# Altium project DE-270624.PrjPcb
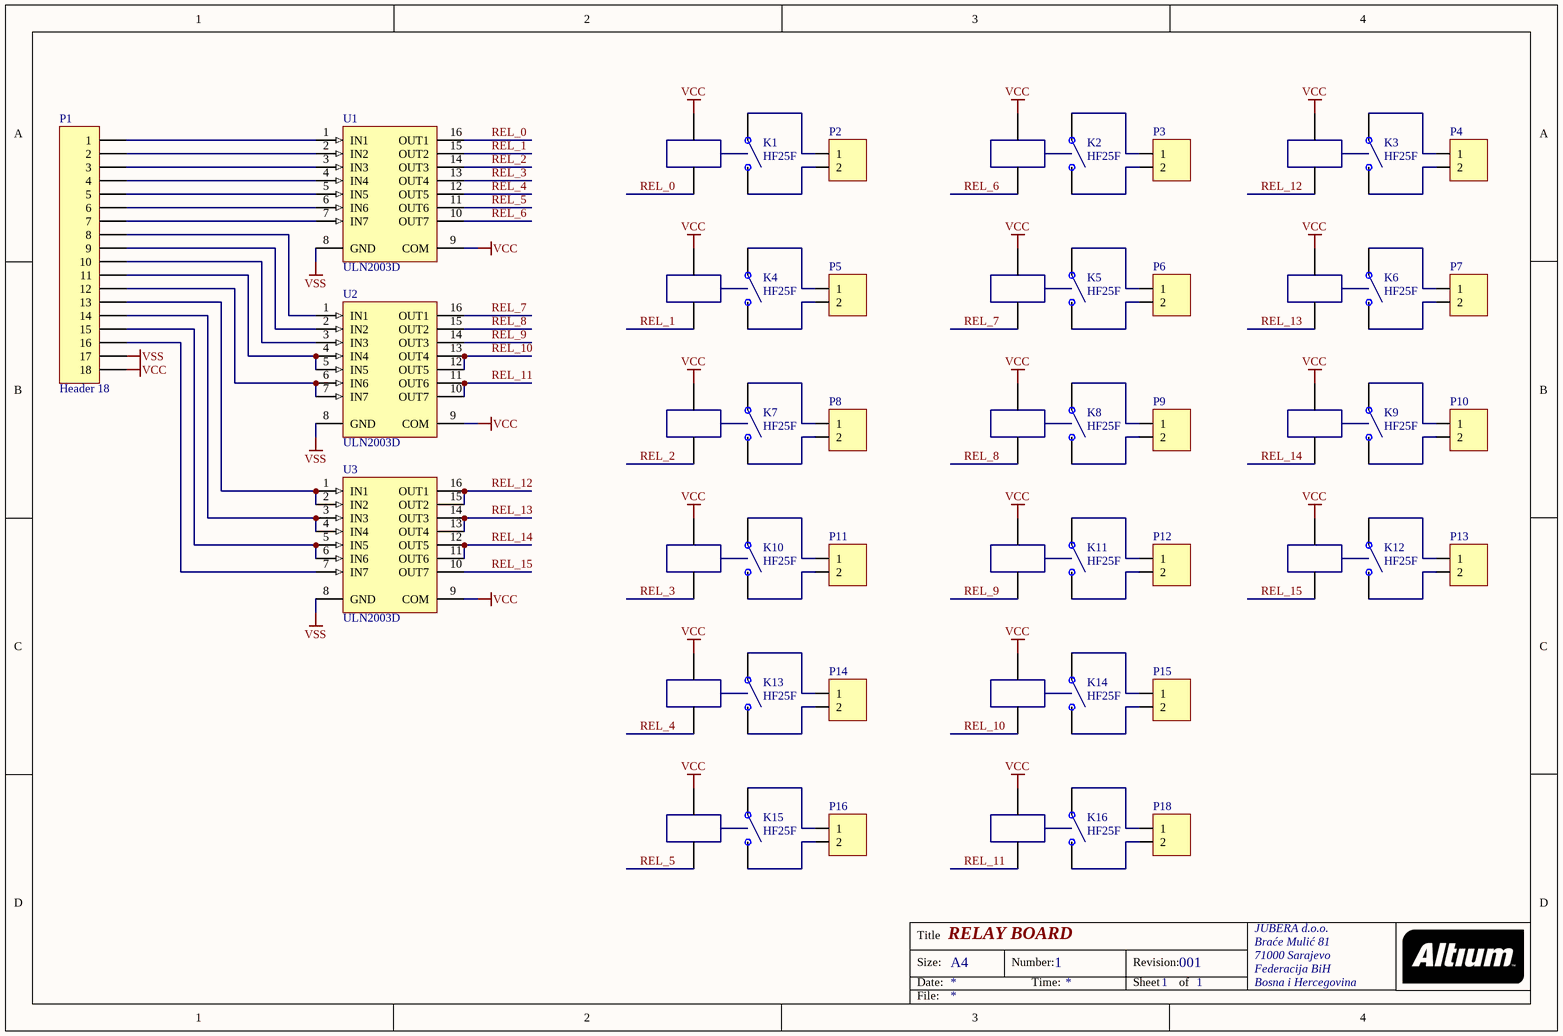
[diagram p0: DE-270624.SchDoc]
1 sheet, 36 parts. Net scope: global (net labels, ports and power ports of the same name join across sheets).
Board file: DE-270624.PcbDoc

## Sheet DE-270624.SchDoc: RELAY BOARD
size A4; Author: eldar6776@hotmail.com; DrawnBy: Eldar Dedić; Organization: JUBERA d.o.o.; Address1: Braće Mulić 81; Address2: 71000 Sarajevo; Address3: Federacija BiH; Address4: Bosna i Hercegovina; DocumentNumber: 1; Revision: 001; SheetNumber: 1; SheetTotal: 1; ProjectName: DE'270124

### Parts
K1  HF25F  [HF25F]
K2  HF25F  [HF25F]
K3  HF25F  [HF25F]
K4  HF25F  [HF25F]
K5  HF25F  [HF25F]
K6  HF25F  [HF25F]
K7  HF25F  [HF25F]
K8  HF25F  [HF25F]
K9  HF25F  [HF25F]
K10  HF25F  [HF25F]
K11  HF25F  [HF25F]
K12  HF25F  [HF25F]
K13  HF25F  [HF25F]
K14  HF25F  [HF25F]
K15  HF25F  [HF25F]
K16  HF25F  [HF25F]
P1  Header 18  [HDR1X18]
P2  220Vac  [TERMINAL BLOK 2 - 3,5mm]  (value not drawn)
P3  220Vac  [TERMINAL BLOK 2 - 3,5mm]  (value not drawn)
P4  220Vac  [TERMINAL BLOK 2 - 3,5mm]  (value not drawn)
P5  220Vac  [TERMINAL BLOK 2 - 3,5mm]  (value not drawn)
P6  220Vac  [TERMINAL BLOK 2 - 3,5mm]  (value not drawn)
P7  220Vac  [TERMINAL BLOK 2 - 3,5mm]  (value not drawn)
P8  220Vac  [TERMINAL BLOK 2 - 3,5mm]  (value not drawn)
P9  220Vac  [TERMINAL BLOK 2 - 3,5mm]  (value not drawn)
P10  220Vac  [TERMINAL BLOK 2 - 3,5mm]  (value not drawn)
P11  220Vac  [TERMINAL BLOK 2 - 3,5mm]  (value not drawn)
P12  220Vac  [TERMINAL BLOK 2 - 3,5mm]  (value not drawn)
P13  220Vac  [TERMINAL BLOK 2 - 3,5mm]  (value not drawn)
P14  220Vac  [TERMINAL BLOK 2 - 3,5mm]  (value not drawn)
P15  220Vac  [TERMINAL BLOK 2 - 3,5mm]  (value not drawn)
P16  220Vac  [TERMINAL BLOK 2 - 3,5mm]  (value not drawn)
P18  220Vac  [TERMINAL BLOK 2 - 3,5mm]  (value not drawn)
U1  ULN2003D  [SO16_N]
U2  ULN2003D  [SO16_N]
U3  ULN2003D  [SO16_N]

### Nets
VCC: K1.1 K2.1 K3.1 K4.1 K5.1 K6.1 K7.1 K8.1 K9.1 K10.1 K11.1 K12.1 K13.1 K14.1 K15.1 K16.1 P1.18 U1.9(COM) U2.9(COM) U3.9(COM)
VSS: P1.17 U1.8(GND) U2.8(GND) U3.8(GND)
REL_0: K1.2 U1.16(OUT1)
REL_1: K4.2 U1.15(OUT2)
REL_2: K7.2 U1.14(OUT3)
REL_3: K10.2 U1.13(OUT4)
REL_4: K13.2 U1.12(OUT5)
REL_5: K15.2 U1.11(OUT6)
REL_6: K2.2 U1.10(OUT7)
REL_7: K5.2 U2.16(OUT1)
REL_8: K8.2 U2.15(OUT2)
REL_9: K11.2 U2.14(OUT3)
REL_10: K14.2 U2.12(OUT5) U2.13(OUT4)
REL_11: K16.2 U2.10(OUT7) U2.11(OUT6)
REL_12: K3.2 U3.15(OUT2) U3.16(OUT1)
REL_13: K6.2 U3.13(OUT4) U3.14(OUT3)
REL_14: K9.2 U3.11(OUT6) U3.12(OUT5)
REL_15: K12.2 U3.10(OUT7)
NetK1_3: K1.3 P2.1
NetK1_4: K1.4 P2.2
NetK2_3: K2.3 P3.1
NetK2_4: K2.4 P3.2
NetK3_3: K3.3 P4.1
NetK3_4: K3.4 P4.2
NetK4_3: K4.3 P5.1
NetK4_4: K4.4 P5.2
NetK5_3: K5.3 P6.1
NetK5_4: K5.4 P6.2
NetK6_3: K6.3 P7.1
NetK6_4: K6.4 P7.2
NetK7_3: K7.3 P8.1
NetK7_4: K7.4 P8.2
NetK8_3: K8.3 P9.1
NetK8_4: K8.4 P9.2
NetK9_3: K9.3 P10.1
NetK9_4: K9.4 P10.2
NetK10_3: K10.3 P11.1
NetK10_4: K10.4 P11.2
NetK11_3: K11.3 P12.1
NetK11_4: K11.4 P12.2
NetK12_3: K12.3 P13.1
NetK12_4: K12.4 P13.2
NetK13_3: K13.3 P14.1
NetK13_4: K13.4 P14.2
NetK14_3: K14.3 P15.1
NetK14_4: K14.4 P15.2
NetK15_3: K15.3 P16.1
NetK15_4: K15.4 P16.2
NetK16_3: K16.3 P18.1
NetK16_4: K16.4 P18.2
NetP1_1: P1.1 U1.1(IN1)
NetP1_2: P1.2 U1.2(IN2)
NetP1_3: P1.3 U1.3(IN3)
NetP1_4: P1.4 U1.4(IN4)
NetP1_5: P1.5 U1.5(IN5)
NetP1_6: P1.6 U1.6(IN6)
NetP1_7: P1.7 U1.7(IN7)
NetP1_8: P1.8 U2.1(IN1)
NetP1_9: P1.9 U2.2(IN2)
NetP1_10: P1.10 U2.3(IN3)
NetP1_11: P1.11 U2.4(IN4) U2.5(IN5)
NetP1_12: P1.12 U2.6(IN6) U2.7(IN7)
NetP1_13: P1.13 U3.1(IN1) U3.2(IN2)
NetP1_14: P1.14 U3.3(IN3) U3.4(IN4)
NetP1_15: P1.15 U3.5(IN5) U3.6(IN6)
NetP1_16: P1.16 U3.7(IN7)

### Notes on the sheet
- Title
- Size:
- Date:
- A4
- Number:
- Time:
- Revision:
- Sheet
- of
- File:

### Library data of the parts
K1-K16 = HF25F: PCB relay 250VAC/20A 30VDC/16A
P1 = Header 18: Header, 18-Pin; LatestRevisionDate: 17-Jul-2002; LatestRevisionNote: Re-released for DXP Platform.; Publisher: Altium Limited
P2-P16 P18 = TERMINAL BLOK 2: Terminal blok konektor 3,5 mm
U1-U3 = ULN2003D: Seven Darlington Array; Published: 8-Jun-2000; LatestRevisionDate: 13-Apr-2006; LatestRevisionNote: IPC-7351 Footprint Added.; DatasheetVersion: Sep-1998; PackageVersion: May-1998; PackageReference: SO16; Publisher: Altium Limited; PackageDescription: 16-Pin Small Outline Integrated Circuit 1.27 mm Pitch; Code_IPC: SOIC127P600-16; ComponentLink1Description: Manufacturer Link; ComponentLink1URL: http://www.st.com/; ComponentLink2Description: Datasheet; ComponentLink2URL: http://www.st.com/stonline/products/literature/ds/5279/uln2001.pdf